# Altium schematic sheet USB.SchDoc
size A4
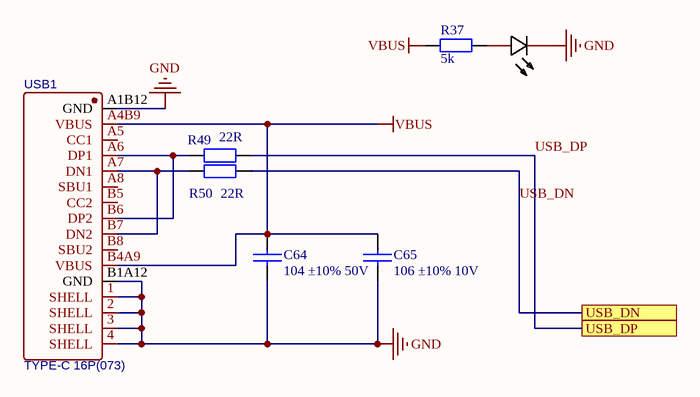
[diagram p0: USB.SchDoc]

## Parts
5  NCD0603R1_C84263  [0603LED]  (value not drawn)
C64  104 ±10% 50V  [0402C]
C65  106 ±10% 10V  [0402C]
R37  5k  [0402R]
R49  22R  [0402R]
R50  22R  [0402R]
USB1  TYPE-C 16P(073)  [USB-C-SMD_16P - duplicate2]

## Ports
USB_DN, USB_DP

## Nets
GND: 5.1(K) C64.1 C65.1 USB1.1(SHELL) USB1.2(SHELL) USB1.3(SHELL) USB1.4(SHELL) USB1.A1B12(GND) USB1.B1A12(GND)
VBUS: C64.2 C65.2 R37.1 USB1.A4B9(VBUS) USB1.B4A9(VBUS)
USB_DN: R50.1 ; port USB_DN
USB_DP: R49.1 ; port USB_DP
Net5_2: 5.2(A) R37.2
NetR49_2: R49.2 USB1.A6(DP1) USB1.B6(DP2)
NetR50_2: R50.2 USB1.A7(DN1) USB1.B7(DN2)

Not connected (* = marked no-connect by the designer): USB1 A5(CC1) A8(SBU1) B5(CC2) B8(SBU2)

## Library data of the parts
5 = 0603LED: Manufacturer: 国星光电; Symbol: FC-DA1608HRK-620D; Add into BOM: yes; Emitted Color: 红色; Forward Voltage (VF): 1.6V~2.6V; Power Dissipation: 65mW; Forward Current: 20mA; Dominant Wavelength: 615nm~630nm; Diode Configuration: 独立二极管; Lens Color: 无色透明; Luminous Intensity: 80mcd~220mcd; Viewing Angle: 130°; Device: NCD0603R1_C84263; Supplier: LCSC; Manufacturer Part: NCD0603R1; Supplier Part: C84263; JLCPCB Part Class: Extended Part; LCSC Part Name: NCD0603R1; Supplier Footprint: 0603; Datasheet: https://atta.szlcsc.com/upload/public/pdf/source/20200820/C84263_DABC6A75E58F576973B407FDBA283D60.pdf; Convert to PCB: yes; Lamp Holder Type: -; Peak Wavelength: -; Color Temperature: -; Mounting Sytle: -; Operating Temperature: -30℃~+85℃
C64 C65 = C: Capacitor
R37 = Res2: Resistor; Value: 10K; Published: 8-Jun-2000; LatestRevisionDate: 17-Jul-2002; LatestRevisionNote: Re-released for DXP Platform.; PackageReference: AXIAL-0.4; Publisher: Altium Limited; PackageDescription: Axial Device, Thru-Hole; 2 Leads; 0.4 in Pin Spacing
R49 R50 = RES: 贴片电阻
USB1 = TYPE-C 16P(073): BOM_Manufacturer: SHOU HAN; Contributor: LCSC; BOM_Supplier: LCSC; BOM_Supplier Part: C668624; BOM_Manufacturer Part: TYPE-C 16P(073); spicePre: U; spiceSymbolName: TYPE-C 16P(073)